# EAGLE design Benchtop Power Supply-v13 (EAGLE 6.5.0)
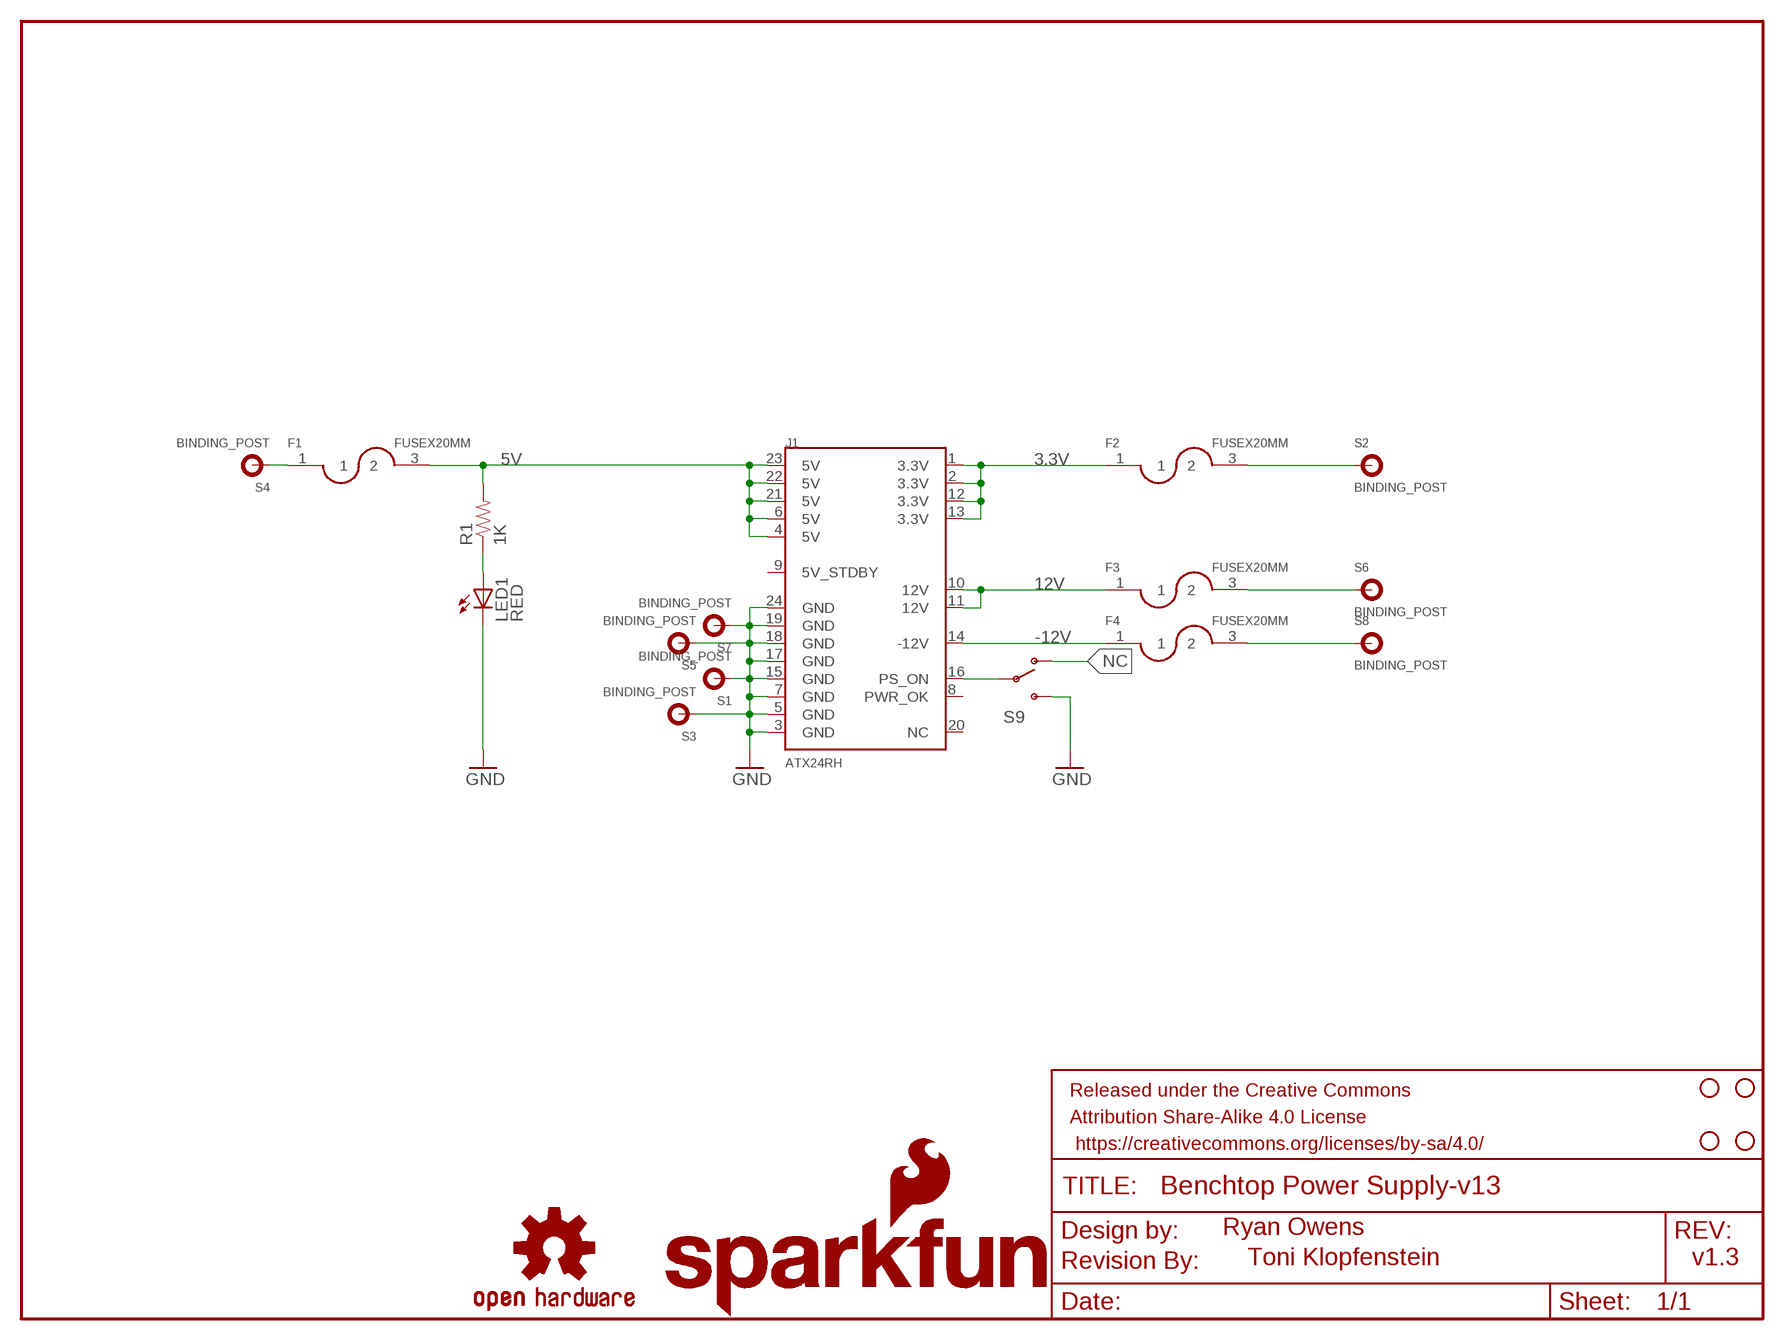
[diagram p0: schematic, sheet 1]

## Parts
F1  FUSEX20MM  [FUSE_5MM]
F2  FUSEX20MM  [FUSE_5MM]
F3  FUSEX20MM  [FUSE_5MM]
F4  FUSEX20MM  [FUSE_5MM]
FRAME1  FRAME-LETTER  [CREATIVE_COMMONS]
J1  ATX24RH  [ATX24_RIGHT_ANGLE]
JP1  SFE_LOGO_NAME_FLAME.3_INCH  [SFE_LOGO_NAME_FLAME_.3]
JP2  STAND-OFF  [STAND-OFF]
JP3  STAND-OFF  [STAND-OFF]
JP4  STAND-OFF  [STAND-OFF]
JP5  STAND-OFF  [STAND-OFF]
LED1  RED  LED5MM  [LED5MM]
LOGO1  OSHW-LOGOL  [OSHW-LOGO-L]
R1  1K  RESISTORPTH1  [AXIAL-0.3]
S1  BINDING_POST  [BINDING_POST]
S2  BINDING_POST  [BINDING_POST]
S3  BINDING_POST  [BINDING_POST]
S4  BINDING_POST  [BINDING_POST]
S5  BINDING_POST  [BINDING_POST]
S6  BINDING_POST  [BINDING_POST]
S7  BINDING_POST  [BINDING_POST]
S8  BINDING_POST  [BINDING_POST]
S9  SWITCH-SPDTKIT  [SWITCH-SPDT_KIT]
U$1  REVISION  [REVISION]

## Nets
3.3V: F2.1 J1.1(3.3V) J1.2(3.3V) J1.12(3.3V) J1.13(3.3V)
3.3V_P: F2.3 S2.P$1
5V: F1.3 J1.4(5V) J1.6(5V) J1.21(5V) J1.22(5V) J1.23(5V) R1.P$2
5V_P: F1.1 S4.P$1
12V: F3.1 J1.10(12V) J1.11(12V)
12V_P: F3.3 S6.P$1
-12V: F4.1 J1.14(-12V)
-12V_P: F4.3 S8.P$1
GND: J1.3(GND) J1.5(GND) J1.7(GND) J1.15(GND) J1.17(GND) J1.18(GND) J1.19(GND) J1.24(GND) LED1.K(C) S1.P$1 S3.P$1 S5.P$1 S7.P$1 S9.3(S)
N$1: LED1.A R1.P$1
N$2: J1.16(PS_ON) S9.2(P)
NC: S9.1(O)
Unconnected: J1.8(PWR_OK) J1.9(5V_STDBY) J1.20(NC)

## Notes on the sheet
- Ryan Owens
- Toni Klopfenstein | v1.3

## Library data of the parts
F1-F4 = SparkFun:FUSE
FRAME1 = SparkFun-Aesthetics:FRAME-LETTER: Schematic Frame Standard 8.5x11 US Letter frame
J1 = SparkFun-Connectors:ATX24: ATX24 Pin Power Supply Connector This is a good connector for connecting a computer power supply to a PCB. It's massive, but provides many amps of power at 5V and 12V. SKU: PRT-09498
JP1 = SparkFun-Aesthetics:SFE_LOGO_NAME_FLAME: SFE Logo, name and flame This is the SparkFun full logo. The logo on the schematic will always be the same size; the package variant is the height of the flame part of the logo. Default layer for the logo on the board is tSilk.
JP2-JP5 = SparkFun-Electromechanical:STAND-OFF: #4 Stand Off This is the mechanical footprint for a #4 phillips button head screw. Use the keepout ring to avoid running the screw head into surrounding components. SKU : PRT-00447
LED1 = SparkFun:LED: LEDs Standard schematic elements and footprints for 5mm, 3mm, 1206, and 0603 sized LEDs. 5mm - Spark Fun Electronics SKU : COM-00529 (and others)
LOGO1 = SparkFun-Aesthetics:OSHW-LOGO: Open Source Hardware Logo This logo indicates the piece of hardware it is found on incorporates a OSHW license and/or adheres to the definition of open source hardware found here: http://freedomdefined.org/OSHW
R1 = SparkFun:RESISTOR: Resistor Basic schematic elements and footprints for 0603, 1206, and PTH 1/10th watt (small) resistors.
S1-S8 = SparkFun-Connectors:BINDING_POST: Single Banana jack. PRT-09739 (red) or PRT-09740 (blk) Footprint is a bit strange. The component itself has an threaded, insulated body that goes through the board, with a small threaded metal stud coming off the back. The intent of this package is that the post goes through a milled obling hole, and a small wire would be used to connect from the PCB pad to the metal contact on the post.
S9 = SparkFun-Electromechanical:SWITCH-SPDT: SPDT Switch Simple slide switch, Spark Fun Electronics SKU : COM-00102 DPDT SMT slide switch, AYZ0202, SWCH-08179; PROD_ID: SWCH-08261
U$1 = SparkFun-Aesthetics:REVISION

## Board
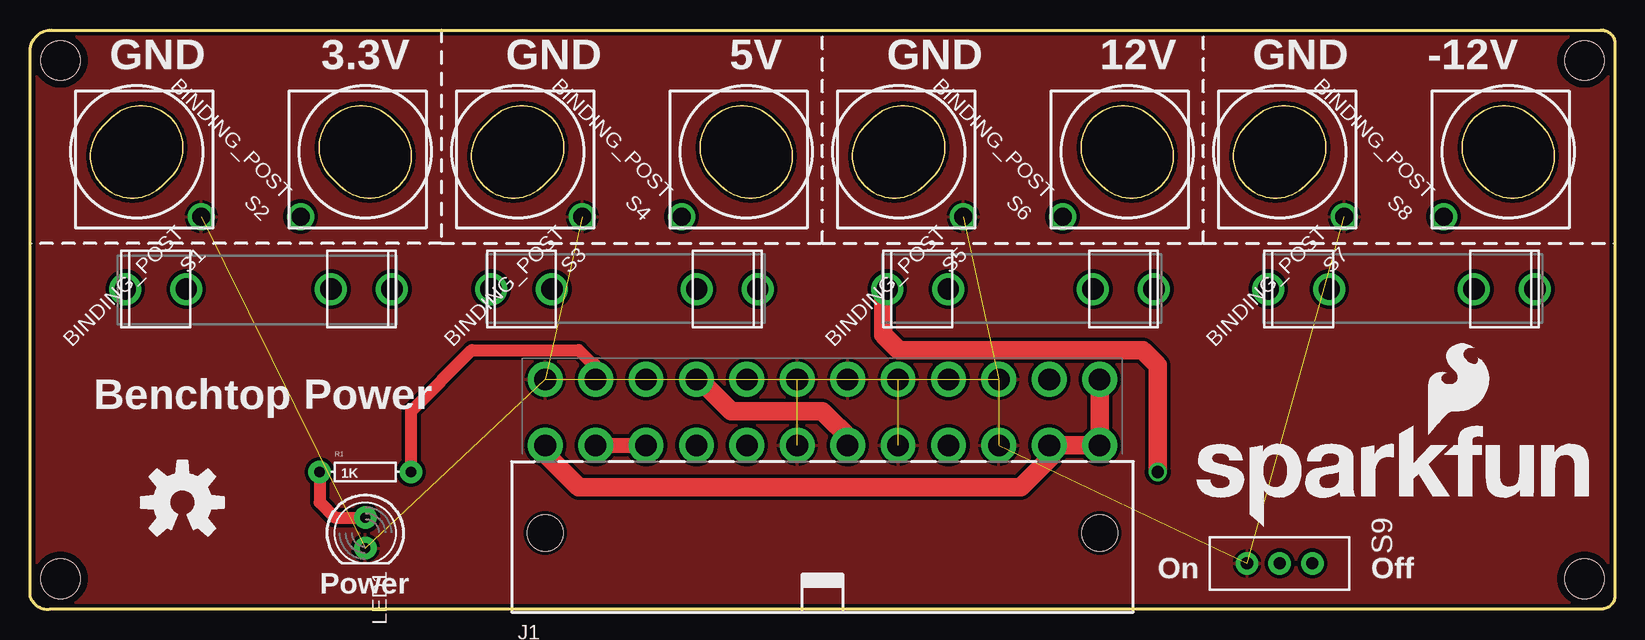
[diagram p1: board, top side]
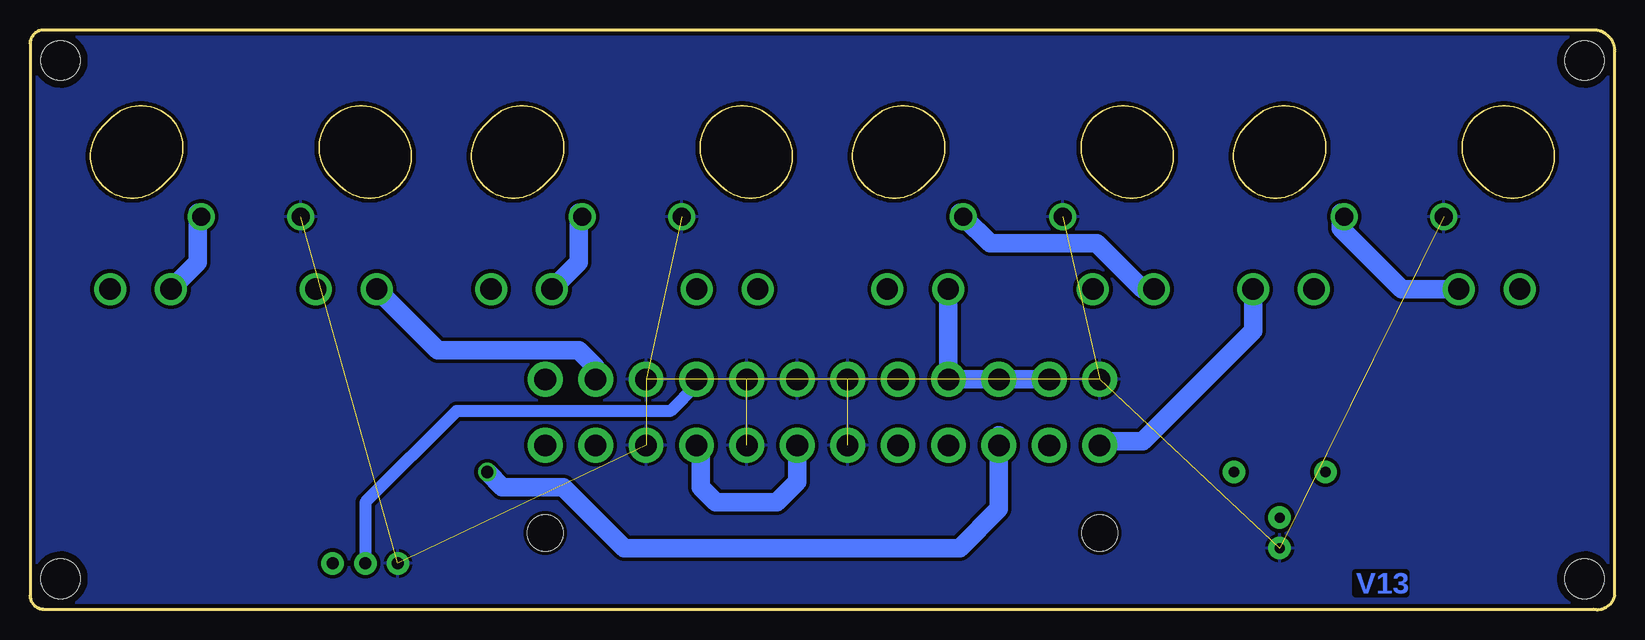
[diagram p2: board, bottom side, seen from below]

Size 132.08 x 48.29 mm. Coordinates in mm from the lower left corner, seen from the top.
Outline: 1.8,48.29 130.94,48.29 arc-90 132.08,47.15 132.08,1.18 arc-90 130.94,0.03 1.8,0.03 arc-90 0,1.18 0,46.5 arc-90 1.8,48.29
Copper layers (1*16): Top 0.035mm / dielectric 1.5mm / Bottom 0.035mm
Design rules "SparkFun-2-layer": minimum track width 7mil, minimum drill 15mil, track to track 8mil, track to pad 8mil, pad to pad 8mil, via to via 8mil, smd to smd 8mil, copper to edge 8mil, drill to drill 8mil, minimum pad ring 12mil, minimum via ring 10mil, stop-mask expansion 4mil, vias tented up to drill 20mil, thermal gap 10mil

### Footprints (pad centres in the part's own frame; a part is rotated, then mirrored left to right if it is on the bottom)
FUSE_5MM = drill 1.778: 1 0,-11.113; 2 0,-6.032; 3 0,6.032; 4 0,11.113
ATX24_RIGHT_ANGLE = drill 1.8 pad 2.9: 1 23.1,4.76; 2 18.9,4.76; 3 14.7,4.76; 4 10.5,4.76; 5 6.3,4.76; 6 2.1,4.76; 7 -2.1,4.76; 8 -6.3,4.76; 9 -10.5,4.76; 10 -14.7,4.76; 11 -18.9,4.76; 12 -23.1,4.76; 13 23.1,10.26; 14 18.9,10.26; 15 14.7,10.26; 16 10.5,10.26; 17 6.3,10.26; 18 2.1,10.26; 19 -2.1,10.26; 20 -6.3,10.26; 21 -10.5,10.26; 22 -14.7,10.26; 23 -18.9,10.26; 24 -23.1,10.26 | hole 3: -23.1,-2.54; 23.1,-2.54
STAND-OFF = hole 3.302: 0,0
LED5MM = drill 0.813 pad 1.88: A -1.27,0; K 1.27,0
AXIAL-0.3 = drill 0.9 pad 1.88: P$1 -3.81,0; P$2 3.81,0
BINDING_POST = drill 1.5: P$1 0,7.62
SWITCH-SPDT_KIT = drill 1.016 pad 1.88: 1 0,2.718; 2 0,0; 3 0,-2.718

### Placement (x,y rotation side)
F1  49.53,26.7 270 top
F2  19.05,26.7 90 top
F3  82.55,26.7 270 top
F4  114.3,26.7 270 top
FRAME1  24.66,-8.86 0 top  (outside the outline)
J1  66.04,8.92 0 top
JP1  96.65,6.77 0 top
JP2  129.54,2.57 0 top
JP3  129.54,45.75 0 top
JP4  2.54,2.57 0 top
JP5  2.54,45.75 0 top
LED1  27.94,6.38 270 top
LOGO1  12.7,8.92 0 top
R1  27.94,11.46 0 top
S1  8.89,38.13 225 top
S2  27.94,38.13 135 top
S3  40.64,38.13 225 top
S4  59.69,38.13 135 top
S5  72.39,38.13 225 top
S6  91.44,38.13 135 top
S7  104.14,38.13 225 top
S8  123.19,38.13 135 top
S9  104.14,3.84 270 top
U$1  35.56,-12.67 0 top  (outside the outline)

### Tracks (layer width: path | path; a pad name or v marks a point on that pad's centre or on a via)
3.3V
  Top 1.016: 85.09,13.53 J1.2
  Top 1.27: 85.09,12.73 85.09,13.53
  Top 1.524: J1.13 J1.1 J1.2 | J1.12 42.94,12.97 45.72,10.19 82.55,10.19 85.09,12.73
  Bottom 1.27: 42.62,14 J1.12
  Bottom 1.524: F2.1 30.16,23.21 39.37,14 42.62,14
3.3V_P
  Bottom 1.524: F2.3 17.78,26.7 22.86,31.78 22.86,33.05 S2.P$1
5V
  Top 1.016: R1.P$2 31.75,16.54 36.83,21.62 45.72,21.62 46.99,20.35 | 46.99,19.33 J1.23 | 68.52,14.06 J1.6
  Top 1.27: 46.99,20.35 46.99,19.33 | J1.21 55.78,19.18
  Top 1.524: 55.78,19.18 58.42,16.54 66.04,16.54 68.52,14.06
  Bottom 1.27: 55.54,26.68 F1.3
  Bottom 1.524: J1.23 J1.22 J1.21 55.54,26.68 | J1.6 68.14,10.63 69.85,8.92 74.93,8.92 76.2,10.19 76.2,13.34 J1.4
5V_P
  Bottom 1.016: F1.1 39.37,26.7
  Bottom 1.524: 39.37,26.7 43.18,30.51 52.07,30.51 S4.P$1 54.61,33.05
12V  (via drill 1.02)
  Top 1.27: J1.11 J1.10
  Top 1.524: v93.98,11.46 93.98,20.35 92.71,21.62 72.39,21.62 71.12,22.89 71.12,26.7 F3.1
  Bottom 1.016: J1.10 51.34,14.54 | 71.12,26.7 F3.1
  Bottom 1.524: 51.34,14.54 51.34,8.38 54.61,5.11 82.55,5.11 87.63,10.19 92.71,10.19 v93.98,11.46
12V_P
  Bottom 1.524: F3.3 86.36,28.93 86.36,33.05 S6.P$1
-12V
  Bottom 1.524: J1.14 84.94,20.2 86.36,21.62 98.11,21.62 F4.1
-12V_P
  Bottom 1.524: F4.3 118.11,28.93 118.11,33.05 S8.P$1
GND  (13 unrouted)
  pour Bottom (isolate 0.305): 0,0.03 0,48.29 132.08,48.29 132.08,0.03
  pour Top (isolate 0.305): 0,0.03 0,48.29 132.08,48.29 132.08,0.03
N$1
  Top 1.016: R1.P$1 24.13,8.92 25.4,7.65 LED1.A
N$2
  Bottom 1.016: J1.16 76.54,18.74 78.74,16.54 96.52,16.54 104.14,8.92 S9.2

### Text on the board
Bottom: V13
tPlace: GND | 3.3V | GND | 5V | GND | 12V | GND | -12V | Benchtop Power | On | Off | Power
tDocu: ROUTE / OUT | ROUTE / OUT | ROUTE / OUT | ROUTE / OUT | ROUTE / OUT | ROUTE / OUT | ROUTE / OUT | ROUTE / OUT | Ryan Owens | Toni Klopfenstein